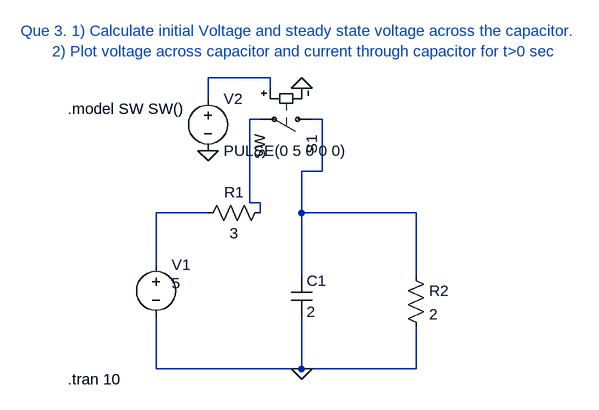
[diagram p0: schematic 3_Dheerendra_23EE019_Transient.asc]
3_Dheerendra_23EE019_Transient.asc, the LTspice schematic file:
Version 4
SHEET 1 880 680
WIRE 224 -144 128 -144
WIRE 224 -128 224 -144
WIRE 128 -112 128 -144
WIRE 208 -80 192 -80
WIRE 304 -80 288 -80
WIRE 304 0 304 -80
WIRE 304 0 272 0
WIRE 192 48 192 -80
WIRE 208 48 192 48
WIRE 128 64 48 64
WIRE 208 64 208 48
WIRE 272 64 272 0
WIRE 448 64 272 64
WIRE 48 144 48 64
WIRE 272 160 272 64
WIRE 448 160 448 64
WIRE 48 304 48 224
WIRE 272 304 272 224
WIRE 272 304 48 304
WIRE 448 304 448 240
WIRE 448 304 272 304
FLAG 272 -128 0
FLAG 128 -32 0
FLAG 272 304 0
SYMBOL voltage 48 128 R0
WINDOW 3 24 44 Left 2
WINDOW 123 0 0 Left 0
WINDOW 39 0 0 Left 0
SYMATTR InstName V1
SYMATTR Value 5
SYMBOL res 224 48 R90
WINDOW 0 0 56 VBottom 2
WINDOW 3 32 56 VTop 2
SYMATTR InstName R1
SYMATTR Value 3
SYMBOL cap 256 160 R0
SYMATTR InstName C1
SYMATTR Value 2
SYMBOL res 432 144 R0
SYMATTR InstName R2
SYMATTR Value 2
SYMBOL sw 304 -80 R90
SYMATTR InstName S1
SYMBOL voltage 128 -128 R0
WINDOW 123 0 0 Left 0
WINDOW 39 0 0 Left 0
SYMATTR InstName V2
SYMATTR Value PULSE(0 5 0 0 0)
TEXT -88 -96 Left 2 !.model SW SW()
TEXT -88 320 Left 2 !.tran 10
TEXT -160 -216 Left 2 ;Que 3. 1) Calculate initial Voltage and steady state voltage across the capacitor.\n       2) Plot voltage across capacitor and current through capacitor for t>0 sec

The netlist it stands for:
* 3_Dheerendra_23EE019_Transient.asc
V1 N004 0 5
R1 N002 N004 3
C1 N003 0 2
R2 N003 0 2
S1 N003 N002 N001 0 SW
V2 N001 0 PULSE(0 5 0 0 0)
.model SW SW()
.tran 10
* Que 3. 1) Calculate initial Voltage and steady state voltage across the capacitor.
*        2) Plot voltage across capacitor and current through capacitor for t>0 sec
.backanno
.end